# Altium schematic sheet AMC_BOX_Backplane.SchDoc: Title
size 420 x 297 mm; Author: G.Kasprowicz; CompanyName: WUT ISE; DrawnBy: G.Kasprowicz; Organization: WUT ISE; Address1: PW ISE; Address2: Nowowiejska 15/19 00-665 Warsaw; Address3: gkasprow@gmail.com; DocumentNumber: 16; Revision: 2; SheetNumber: 16; SheetTotal: 18; ModifiedBy: -; CheckedDate: -; Title2: Title 2; DivGrp: WUT ISE; Designer: G.Kasprowicz; ModifiedDate: -; ProjectName: Sensor Box
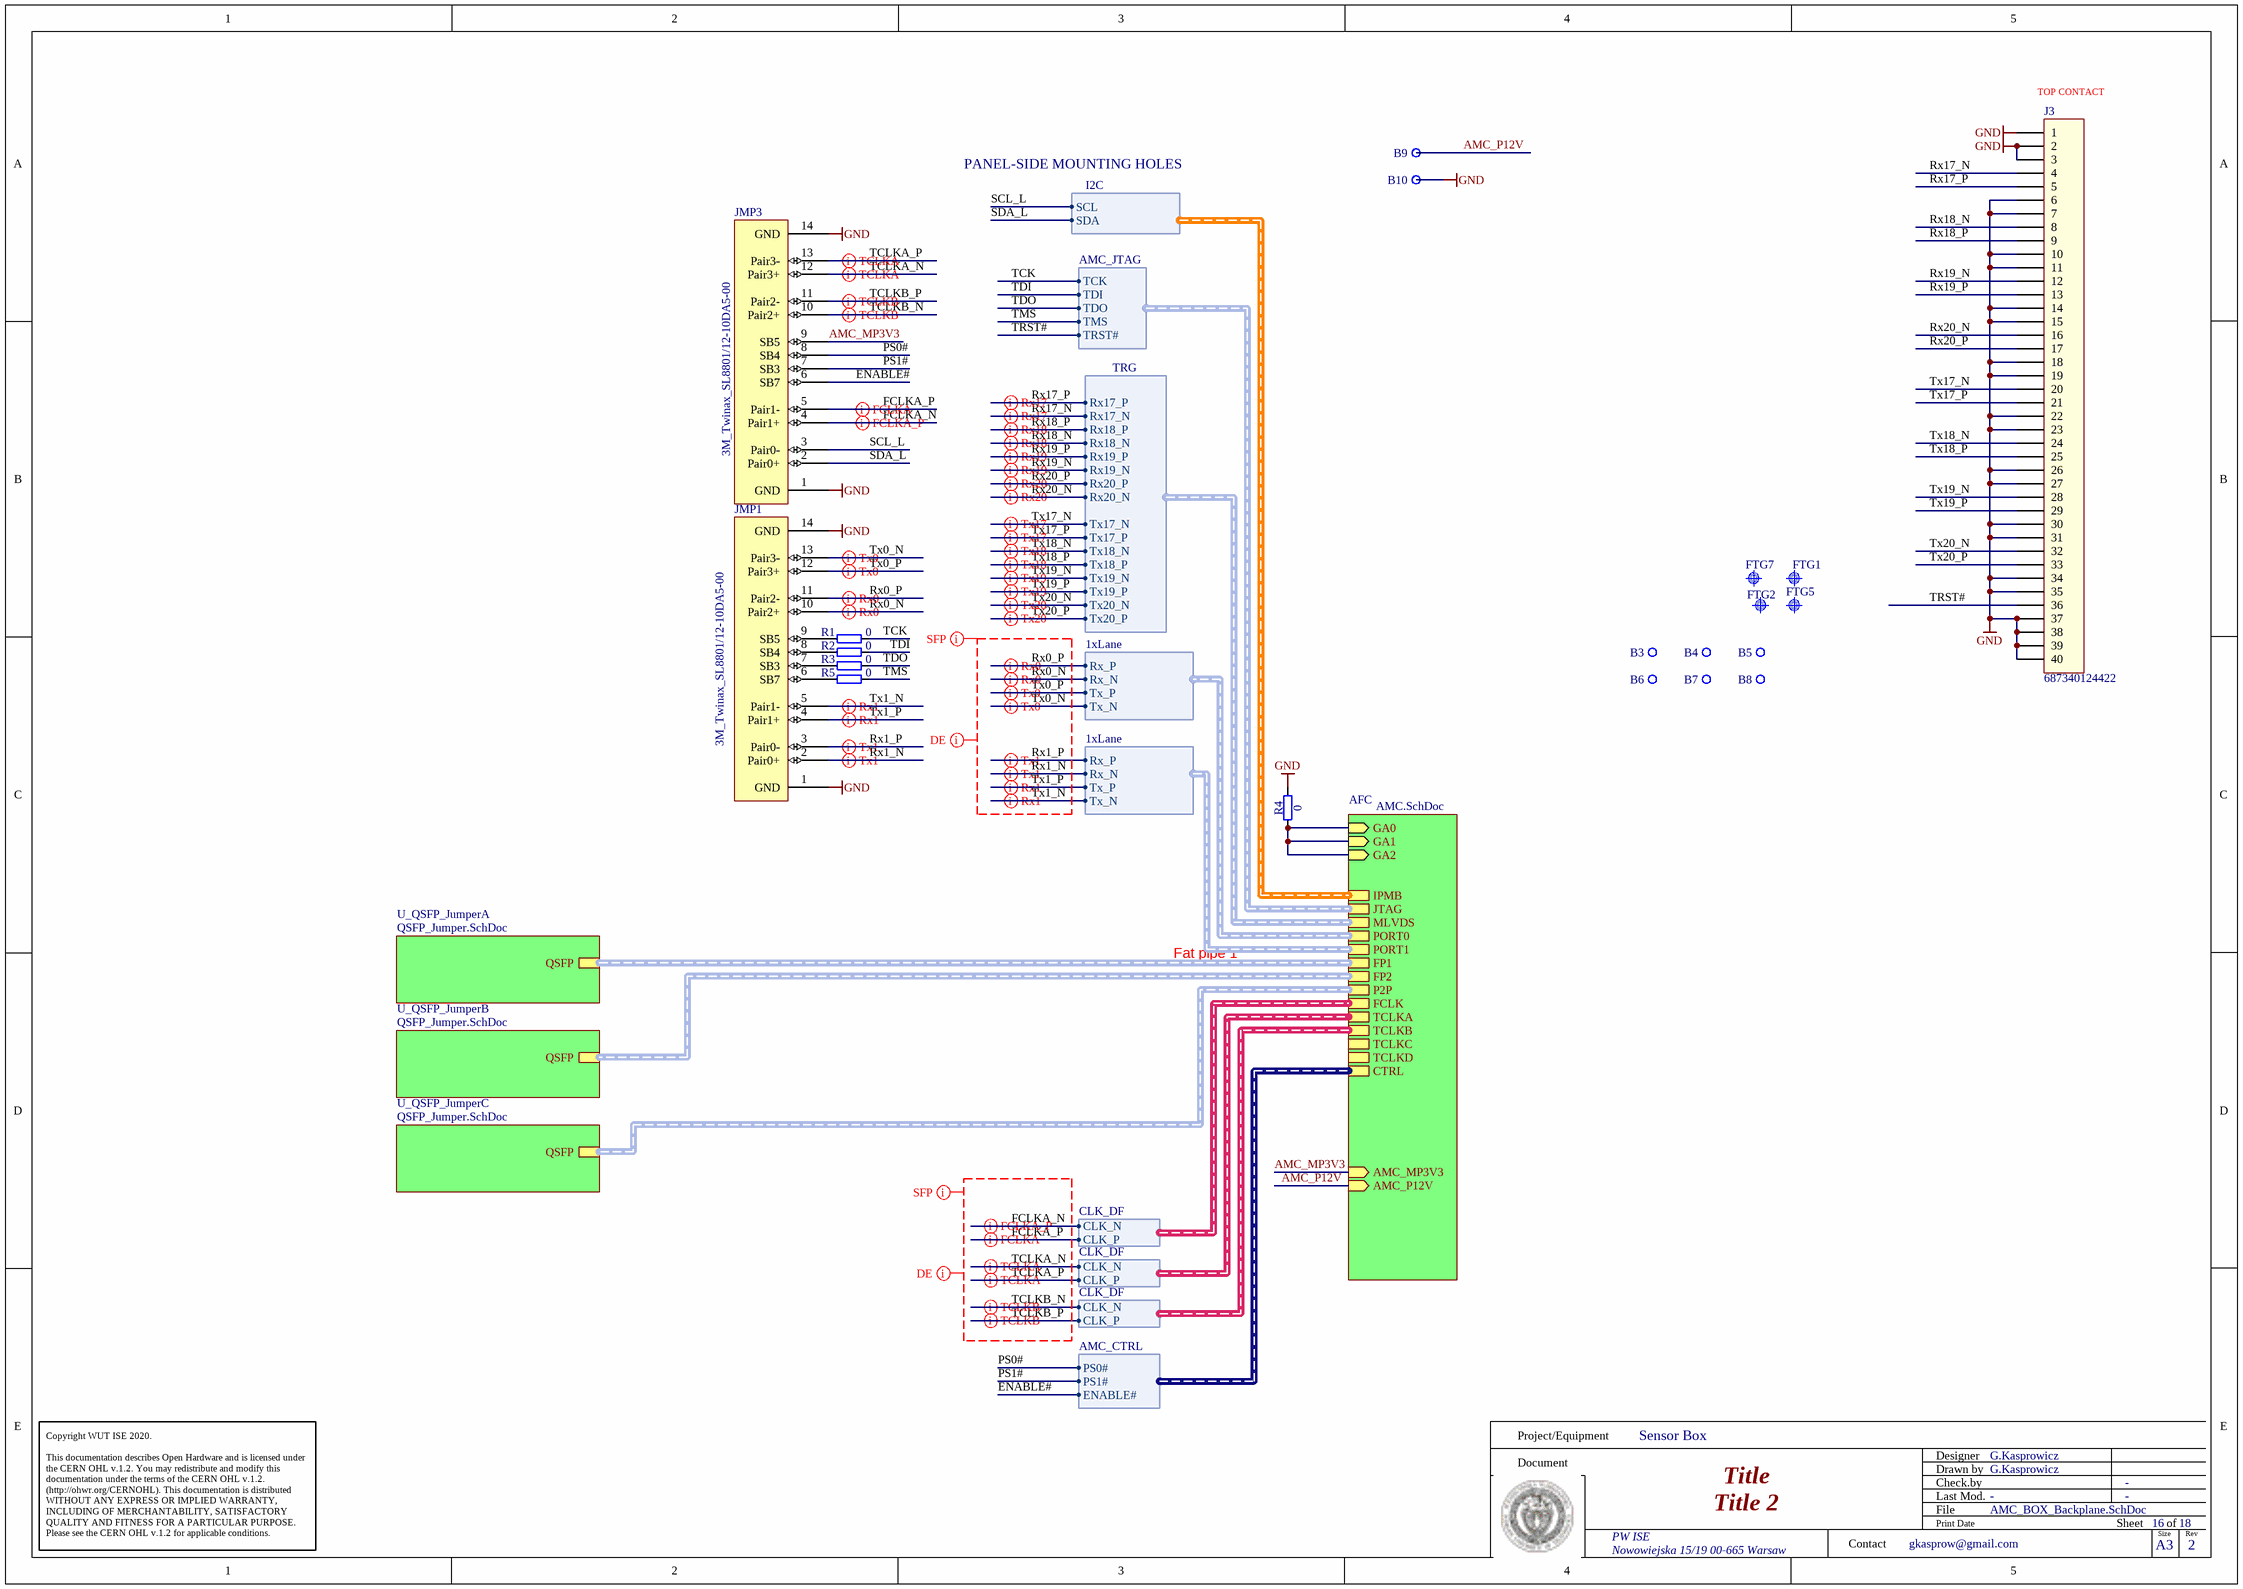
[diagram p0: AMC_BOX_Backplane.SchDoc]

## Parts
B3  Plated Hole  [MTG320_550]  (value not drawn)
B4  Plated Hole  [MTG320_550]  (value not drawn)
B5  Plated Hole  [MTG320_550]  (value not drawn)
B6  Plated Hole  [MTG320_550]  (value not drawn)
B7  Plated Hole  [MTG320_550]  (value not drawn)
B8  Plated Hole  [MTG320_550]  (value not drawn)
B9  Plated Hole  [c200h150]  (value not drawn)
B10  Plated Hole  [c200h150]  (value not drawn)
FTG1  Use only in PCB  [FIDUCIAL_TOP_S100-200]  (value not drawn)
FTG2  Use only in PCB  [FIDUCIAL_TOP_S100-200]  (value not drawn)
FTG5  Use only in PCB  [FIDUCIAL_TOP_S100-200]  (value not drawn)
FTG7  Use only in PCB  [FIDUCIAL_TOP_S100-200]  (value not drawn)
J3  687340124422  [687340124422]
JMP1  3M_Twinax_SL8801/12-10DA5-00  [3M_Twinax_SL8801/12-10DA5-00]
JMP3  3M_Twinax_SL8801/12-10DA5-00  [3M_Twinax_SL8801/12-10DA5-00]
R1  0  [RESC1005X40N]
R2  0  [RESC1005X40N]
R3  0  [RESC1005X40N]
R4  0  [RESC1005X40N]
R5  0  [RESC1005X40N]

## Sub-sheets
AFC = AMC.SchDoc: GA0 (in), GA1 (in), GA2 (in), MLVDS (harness TRG), PORT0 (harness 1xLane), FP2 (harness FP), PORT1 (harness 1xLane), FCLK (harness CLK_DF), TCLKA (harness CLK_DF), TCLKB (harness CLK_DF), TCLKC (harness CLK_DF), TCLKD (harness CLK_DF), FP1 (harness QSFP), AMC_P12V (in), AMC_MP3V3 (in), IPMB (harness I2C), CTRL (harness AMC_CTRL), P2P (harness FP), JTAG (harness AMC_JTAG)
U_QSFP_JumperA = QSFP_Jumper.SchDoc: QSFP (harness QSFP)
U_QSFP_JumperB = QSFP_Jumper.SchDoc: QSFP (harness QSFP)
U_QSFP_JumperC = QSFP_Jumper.SchDoc: QSFP (harness QSFP)

## Harnesses
I2C: SCL, SDA
1xLane: Rx_P, Rx_N, Tx_P, Tx_N
CLK_DF: CLK_P, CLK_N
AMC_CTRL: PS0#, PS1#, ENABLE#
TRG: Rx17_P, Rx17_N, Rx18_P, Rx18_N, Rx19_P, Rx19_N, Rx20_P, Rx20_N, Tx17_N, Tx17_P, Tx18_N, Tx18_P, Tx19_N, Tx19_P, Tx20_N, Tx20_P
AMC_JTAG: TCK, TDI, TDO, TMS, TRST#

## Nets
GND: B10.1 J3.1 J3.2 J3.3 J3.6 J3.7 J3.10 J3.11 J3.14 J3.15 J3.18 J3.19 J3.22 J3.23 J3.26 J3.27 J3.30 J3.31 J3.34 J3.35 J3.37 J3.38 J3.39 J3.40 JMP1.1(GND) JMP1.14(GND) JMP3.1(GND) JMP3.14(GND) R4.2
AMC_MP3V3: JMP3.9(SB5) ; sheet AFC/AMC_MP3V3
AMC_P12V: B9.1 ; sheet AFC/AMC_P12V
ENABLE#: JMP3.6(SB7) ; sheet AFC/CTRL.ENABLE#
FCLKA_N: JMP3.4(Pair1+) ; sheet AFC/FCLK.CLK_N
FCLKA_P: JMP3.5(Pair1-) ; sheet AFC/FCLK.CLK_P
PS0#: JMP3.8(SB4) ; sheet AFC/CTRL.PS0#
PS1#: JMP3.7(SB3) ; sheet AFC/CTRL.PS1#
Rx0_N: JMP1.10(Pair2+) ; sheet AFC/PORT0.Rx_N
Rx0_P: JMP1.11(Pair2-) ; sheet AFC/PORT0.Rx_P
Rx1_N: JMP1.2(Pair0+) ; sheet AFC/PORT1.Rx_N
Rx1_P: JMP1.3(Pair0-) ; sheet AFC/PORT1.Rx_P
Rx17_N: J3.4 ; sheet AFC/MLVDS.Rx17_N
Rx17_P: J3.5 ; sheet AFC/MLVDS.Rx17_P
Rx18_N: J3.8 ; sheet AFC/MLVDS.Rx18_N
Rx18_P: J3.9 ; sheet AFC/MLVDS.Rx18_P
Rx19_N: J3.12 ; sheet AFC/MLVDS.Rx19_N
Rx19_P: J3.13 ; sheet AFC/MLVDS.Rx19_P
Rx20_N: J3.16 ; sheet AFC/MLVDS.Rx20_N
Rx20_P: J3.17 ; sheet AFC/MLVDS.Rx20_P
SCL_L: JMP3.3(Pair0-) ; sheet AFC/IPMB.SCL
SDA_L: JMP3.2(Pair0+) ; sheet AFC/IPMB.SDA
TCK: R1.2 ; sheet AFC/JTAG.TCK
TCLKA_N: JMP3.12(Pair3+) ; sheet AFC/TCLKA.CLK_N
TCLKA_P: JMP3.13(Pair3-) ; sheet AFC/TCLKA.CLK_P
TCLKB_N: JMP3.10(Pair2+) ; sheet AFC/TCLKB.CLK_N
TCLKB_P: JMP3.11(Pair2-) ; sheet AFC/TCLKB.CLK_P
TDI: R2.2 ; sheet AFC/JTAG.TDI
TDO: R3.2 ; sheet AFC/JTAG.TDO
TMS: R5.2 ; sheet AFC/JTAG.TMS
TRST#: J3.36 ; sheet AFC/JTAG.TRST#
Tx0_N: JMP1.13(Pair3-) ; sheet AFC/PORT0.Tx_N
Tx0_P: JMP1.12(Pair3+) ; sheet AFC/PORT0.Tx_P
Tx1_N: JMP1.5(Pair1-) ; sheet AFC/PORT1.Tx_N
Tx1_P: JMP1.4(Pair1+) ; sheet AFC/PORT1.Tx_P
Tx17_N: J3.20 ; sheet AFC/MLVDS.Tx17_N
Tx17_P: J3.21 ; sheet AFC/MLVDS.Tx17_P
Tx18_N: J3.24 ; sheet AFC/MLVDS.Tx18_N
Tx18_P: J3.25 ; sheet AFC/MLVDS.Tx18_P
Tx19_N: J3.28 ; sheet AFC/MLVDS.Tx19_N
Tx19_P: J3.29 ; sheet AFC/MLVDS.Tx19_P
Tx20_N: J3.32 ; sheet AFC/MLVDS.Tx20_N
Tx20_P: J3.33 ; sheet AFC/MLVDS.Tx20_P
NetJMP1_6: JMP1.6(SB7) R5.1
NetJMP1_7: JMP1.7(SB3) R3.1
NetJMP1_8: JMP1.8(SB4) R2.1
NetJMP1_9: JMP1.9(SB5) R1.1
NetR4_1: R4.1 ; sheet AFC/GA0, sheet AFC/GA1, sheet AFC/GA2

Not connected (* = marked no-connect by the designer): B3 1; B4 1; B5 1; B6 1; B7 1; B8 1

## Buses and harness runs
harness sheet AFC/FP1 = sheet U_QSFP_JumperA/QSFP
harness sheet AFC/FP2 = sheet U_QSFP_JumperB/QSFP
harness sheet AFC/P2P = sheet U_QSFP_JumperC/QSFP

## Layout directives
differential pair: FCLKA_N, FCLKA_P, Rx0_N, Rx0_P, Rx1_N, Rx1_P, Rx17_N, Rx17_P, Rx18_N, Rx18_P, Rx19_N, Rx19_P, Rx20_N, Rx20_P, TCLKA_N, TCLKA_P, TCLKB_N, TCLKB_P, Tx0_N, Tx0_P, Tx1_N, Tx1_P, Tx17_N, Tx17_P, Tx18_N, Tx18_P, Tx19_N, Tx19_P, Tx20_N, Tx20_P
net class SFP: FCLKA_N, FCLKA_P, Rx0_N, Rx0_P, Rx1_N, Rx1_P, TCLKA_N, TCLKA_P, TCLKB_N, TCLKB_P, Tx0_N, Tx0_P, Tx1_N, Tx1_P
net class DE: FCLKA_N, FCLKA_P, Rx0_N, Rx0_P, Rx1_N, Rx1_P, TCLKA_N, TCLKA_P, TCLKB_N, TCLKB_P, Tx0_N, Tx0_P, Tx1_N, Tx1_P

## Notes on the sheet
- (near J3) TOP CONTACT
- PANEL-SIDE MOUNTING HOLES
- Fat pipe 1
- Project/Equipment
- Document
- Designer
- Drawn by
- Check.by
- Copyright WUT ISE 2020.
  This documentation describes Open Hardware and is licensed under the CERN OHL v.1.2. You may redistribute and modify this documentation under the terms of the CERN OHL v.1.2. (http://ohwr.org/CERNOHL). This documentation is distributed WITHOUT ANY EXPRESS OR IMPLIED WARRANTY, INCLUDING OF MERCHANTABILITY, SATISFACTORY QUALITY AND FITNESS FOR A PARTICULAR PURPOSE. Please see the CERN OHL v.1.2 for applicable conditions.
- Contact
- File
- Last Mod.
- Print Date
- Sheet
- Size
- A3
- of
- Rev

## Library data of the parts
B3-B8 = PLATED_HOLE3.2_PAD5.5: Single Terminal Socket; Part Description: Plated Through Hole: Hole Dia.=3.2mm Pad Dia.=5.5mm; Mounted: No; Part Number: PLATED_HOLE3.2_PAD5.5; Component Kind: Standard (No BOM); Component Type: Standard (No BOM); Pin Count: 1; Family: Plated Hole; Socket: No; SMD: No; Sense: No; Status: None; ComponentHeight: 0mm; HelpURL: Undefined; Author: CERN DEM JMW; CreateDate: 01.10.2012; LatestRevisionDate: 01.10.2012; PackageDescription: Plated Through Hole: Hole Dia.=3.2mm Pad Dia.=5.5mm
B9 B10 = PLATED_HOLE1.5_PAD2.0: Single Terminal Socket; Part Description: Plated Through Hole: Hole Dia.=1.5mm Pad Dia.=2.0mm, IPC-7251 Level C; Mounted: No; Part Number: PLATED_HOLE1.5_PAD2.0; Component Kind: Standard (No BOM); Component Type: Standard (No BOM); Pin Count: 1; Family: Plated Hole; Socket: No; SMD: No; Sense: No; Status: None; ComponentHeight: 0mm; HelpURL: Undefined; Author: CERN DEM JLC; CreateDate: 30.10.2008; LatestRevisionDate: 30.10.2008; PackageDescription: Plated Through Hole: Hole Dia.=1.5mm Pad Dia.=2.0mm, IPC-7251 Level C
FTG1 FTG2 FTG5 FTG7 = FIDUCIAL_TARGET_S100-200: Fiducial Target; Part Description: Square Fiducial Target, Top Layer, 1.0mm, Top Solder 2.0mm, Keepout =2.0mm; Mounted: No; Table: Pads; Part Number: FIDUCIAL_TARGET_S100-200; Component Kind: Standard (No BOM); Component Type: Standard (No BOM); Pin Count: 1; Family: Fiducial; Socket: No; SMD: Yes; Status: None; ComponentHeight: 0mm; Author: CERN DEM JLC; CreateDate: 2010-02-09; LatestRevisionDate: 2012-04-04; PackageDescription: Square Fiducial Target, Top Layer, 1.0mm, Top Solder 2.0mm, Keepout =2.0mm
J3 = 687340124422: 0.50 mm SMT ZIF Vertical WR-FPC, 40 pins; Pitch: 0.5 mm; Pin Number: 40; ComponentLink1Description: Manufacturer; ComponentLink1URL: http://www.we-online.de; ComponentLink2Description: Datasheet; ComponentLink2URL: http://katalog.we-online.com/em/datasheet/6873xx124422.pdf; Part Number: 687340124422; Published Date: April 2017; Publisher: Wurth Elektronik
JMP1 JMP3 = CBL_TWINAX_3M_4pairs_SB: Flat Ribbon Cable Silver 8 (4 Pair) Conductors 0.093" (2.37mm) Between Pairs Flat Twin Axial 500.0' (152.40m)
R1-R5 = R0402_0R_JUMPER: Resistor; Part Description: 1A (0.05R Max DC Resistance) Zero Ohm Jumper; Manufacturer: GENERIC; Manufacturer1 Part Number: 232270591001L; Table: Resistors SMD; Part Number: R0402_0R_JUMPER; Component Kind: Standard; Component Type: Standard; Pin Count: 2; Value: 0; Status: Not recommended; Manufacturer Part Number: R0402_0R_JUMPER; Case: 0402; Mounted: Yes; Socket: No; SMD: Yes; Manufacturer1 Example: YAGEO PHYCOMP; Manufacturer1 ComponentHeight: 0.4mm; HelpURL: \\cern.ch\dfs\Applications\Altium\Datasheets\R0402_Phycomp_RC0402.pdf; Author: CERN DEM JLC; CreateDate: 2007-12-03; LatestRevisionDate: 2012-10-17